# Altium schematic sheet [03] - MODULE BLE.SchDoc
size A3; CompanyName: FPT-FTI copporation; Address1: FPT Building Duy Tan; Address2: Floor 4,; DocumentNumber: 3; SheetNumber: 3; SheetTotal: 8; NameAuthor: Angle Vu
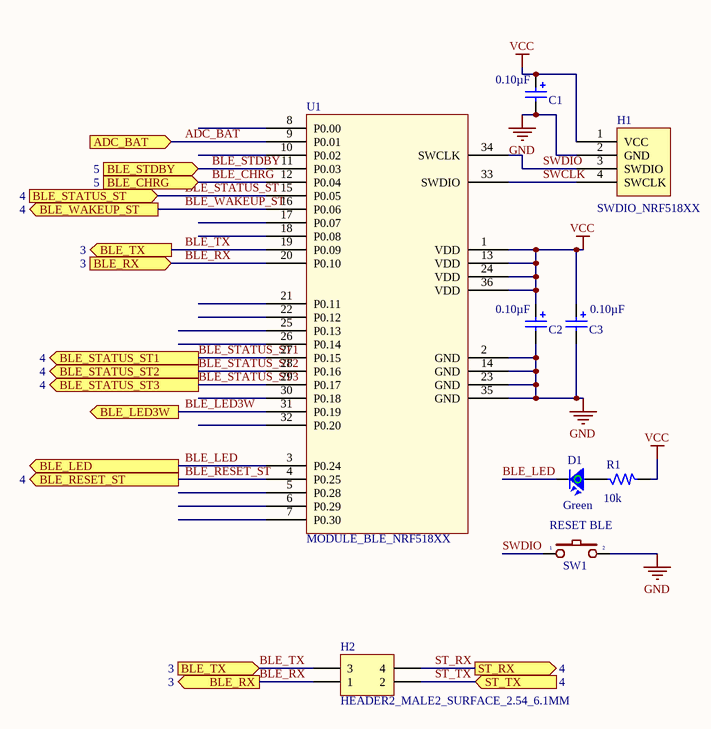
[diagram p0: [03] - MODULE BLE.SchDoc]

## Parts
C1  Capacitance: 0.10µF  [CAP_SMD0603]  (hidden comment: C_104_0603_CERAMIC_16V)
C2  Capacitance: 0.10µF  [CAP_SMD0603]  (hidden comment: C_104_0603_CERAMIC_16V)
C3  Capacitance: 0.10µF  [CAP_SMD0603]  (hidden comment: C_104_0603_CERAMIC_16V)
D1  Color: Green  [LED_GREEN_SMD0603]  (hidden comment: LED2_GREEN_0603_2V)
H1  SWDIO_NRF518XX  [HEADER4_ISP_NRF518xx_SUR1.27]
H2  HEADER2_MALE2_SURFACE_2.54_6.1MM  [HEADER2_MALE2_SUR2.54]
R1  Resistance (Ohms): 10k  [RES_SMD0603]  (hidden comment: R_10K_SMD0603_1%_1/10W)
SW1  RESET BLE  [SW2-SMD]
U1  MODULE_BLE_NRF518XX  [MODULE_NRF518xx]

## Ports
ADC_BAT (in), BLE_CHRG (in, see 5), BLE_LED3W (out), BLE_LED (out), BLE_RESET_ST (out, see 4), BLE_RX (in, see 3), BLE_RX (out, see 3), BLE_STATUS_ST1 (out, see 4), BLE_STATUS_ST2 (out, see 4), BLE_STATUS_ST3 (out, see 4), BLE_STATUS_ST (in, see 4), BLE_STDBY (in, see 5), BLE_TX (in, see 3), BLE_TX (out, see 3), BLE_WAKEUP_ST (out, see 4), ST_RX (out, see 4), ST_TX (in, see 4)

## Nets
GND: C1.2 C2.2 C3.2 H1.2(GND) SW1.2 U1.2(GND) U1.14(GND) U1.23(GND) U1.35(GND)
VCC: C1.1 C2.1 C3.1 H1.1(VCC) R1.2 U1.1(VDD) U1.13(VDD) U1.24(VDD) U1.36(VDD)
ADC_BAT: U1.9(P0.01) ; port ADC_BAT
BLE_CHRG: U1.12(P0.04) ; port BLE_CHRG
BLE_LED: D1.2 U1.3(P0.24) ; port BLE_LED
BLE_LED3W: U1.31(P0.19) ; port BLE_LED3W
BLE_RESET_ST: U1.4(P0.25) ; port BLE_RESET_ST
BLE_RX: H2.1 U1.20(P0.10) ; port BLE_RX
BLE_STATUS_ST: U1.15(P0.05) ; port BLE_STATUS_ST
BLE_STATUS_ST1: U1.27(P0.15) ; port BLE_STATUS_ST1
BLE_STATUS_ST2: U1.28(P0.16) ; port BLE_STATUS_ST2
BLE_STATUS_ST3: U1.29(P0.17) ; port BLE_STATUS_ST3
BLE_STDBY: U1.11(P0.03) ; port BLE_STDBY
BLE_TX: H2.3 U1.19(P0.09) ; port BLE_TX
BLE_WAKEUP_ST: U1.16(P0.06) ; port BLE_WAKEUP_ST
ST_RX: H2.4 ; port ST_RX
ST_TX: H2.2 ; port ST_TX
SWCLK: H1.4(SWCLK) U1.33(SWDIO)
SWDIO: H1.3(SWDIO) SW1.1 U1.34(SWCLK)
NetD1_1: D1.1 R1.1

Not connected (* = marked no-connect by the designer): U1 5(P0.28) 6(P0.29) 7(P0.30) 8(P0.00) 10(P0.02) 17(P0.07) 18(P0.08) 21(P0.11) 22(P0.12) 25(P0.13) 26(P0.14) 30(P0.18) 32(P0.20)

## Notes on the sheet
- Designed By
- Checked By
- Company:
- Size:
- A3
- Address:
- Sheet:
- /

## Library data of the parts
C1-C3 = C_104_0603_CERAMIC_16V: CAP CER 0.1UF 16V X7R 0603; Manufacturer: Murata Electronics North America; Manufacturer Part Number: GRM188R71C104KA01D; Tolerance: ±10%; Supplier 1: Digi-Key; RoHS: RoHS Compliant; Category: Capacitors; Stock 1: 3132000; Pricing 1: 4000=0.00359, 8000=0.00328, 12000=0.00312, 28000=0.00296, 100000=0.00215 (USD); Packaging: Tape & Reel (TR); Part Status: Active; Voltage - Rated: 16V; Temperature Coefficient: X7R; Mounting Type: Surface Mount, MLCC; Operating Temperature: -55°C ~ 125°C; Applications: General Purpose; Ratings: -; Package / Case: 0603 (1608 Metric); Size / Dimension: 0.063" L x 0.031" W (1.60mm x 0.80mm); Height - Seated (Max): -; Thickness (Max): 0.035" (0.90mm); Lead Spacing: -; Features: -; Lead Style: -; ComponentLink1URL: http://www.murata.com/~/media/webrenewal/support/library/catalog/products/capacitor/mlcc/c02e.pdf; ComponentLink1Description: http://www.murata.com/~/media/webrenewal/support/library/catalog/products/capacitor/mlcc/c02e.pdf; Supplier Part Number 1: 490-1532-2-ND
D1 = LED2_GREEN_0603_2V: LED GREEN CLEAR 0603 SMD; Manufacturer: Lite-On Inc.; Manufacturer Part Number: LTST-C191KGKT; Lens Color: Colorless; Millicandela Rating: 35mcd; Lens Style/Size: Rectangle with Flat Top, 1.10mm x 0.80mm; Voltage - Forward (Vf) (Typ): 2V; Current - Test: 20mA; Viewing Angle: 130°; Wavelength - Dominant: 571nm; Wavelength - Peak: 574nm; Supplier 1: Digi-Key; RoHS: RoHS Compliant; Category: Optoelectronics; Stock 1: 960000; Pricing 1: 5000=0.0404, 10000=0.03636, 25000=0.03232, 50000=0.02929, 125000=0.02727 (USD); Packaging: Tape & Reel (TR); Part Status: Active; Lens Transparency: Clear; Mounting Type: Surface Mount; Features: -; Package / Case: 0603 (1608 Metric); Supplier Device Package: *; Size / Dimension: 1.60mm L x 0.80mm W; Height (Max): 0.55mm; ComponentLink1URL: http://optoelectronics.liteon.com/upload/download/DS22-2000-228/S_110_LTST-C191KGKT.pdf; ComponentLink1Description: http://optoelectronics.liteon.com/upload/download/DS22-2000-228/S_110_LTST-C191KGKT.pdf; Supplier Part Number 1: 160-1446-2-ND
H1 = HEADER4_ISP_NRF518XX_HOLE_2.54: CONN HEADER 4POS .100 STR TIN; Manufacturer: Amphenol FCI; Manufacturer Part Number: 68002-404HLF; Connector Type: Header, Unshrouded; Number of Positions: 4; Number of Positions Loaded: All; Pitch: 0.100" (2.54mm); Supplier 1: Digi-Key; RoHS: RoHS Compliant; Category: Connectors, Interconnects; Stock 1: 5773; Pricing 1: 1=0.2, 10=0.186, 25=0.1588, 100=0.129, 250=0.11408, 500=0.10912, 1000=0.08928, 2500=0.08184, 5000=0.07936 (USD); Packaging: Bulk; Part Status: Active; Contact Type: Male Pin; Number of Rows: 1; Row Spacing: -; Contact Mating Length: 0.230" (5.84mm); Mounting Type: Through Hole; Termination: Solder; Fastening Type: -; Features: -; Contact Finish: Tin; Contact Finish Thickness: 100µin (2.54µm); Color: Black; ComponentLink1URL: http://portal.fciconnect.com/Comergent//fci/drawing/68000.pdf; ComponentLink1Description: http://portal.fciconnect.com/Comergent//fci/drawing/68000.pdf; Supplier Part Number 1: 609-3305-ND
H2 = HEADER2_MALE2_SURFACE_2.54_6.1MM: CONN HEADER 4POS TIN SMD; Manufacturer: Molex, LLC; Manufacturer Part Number: 0015912040; Connector Type: Header, Unshrouded, Breakaway; Number of Positions: 4; Number of Positions Loaded: All; Pitch: 0.100" (2.54mm); Supplier 1: Digi-Key; RoHS: RoHS Compliant; Category: Connectors, Interconnects; Stock 1: 10914; Pricing 1: 1=0.44, 10=0.42, 25=0.3596, 50=0.3058, 100=0.2938, 250=0.2638, 500=0.2518, 1000=0.20983, 2500=0.19184 (USD); Packaging: Bulk; Part Status: Active; Contact Type: Male Pin; Number of Rows: 2; Row Spacing: 0.100" (2.54mm); Contact Mating Length: 0.240" (6.10mm); Mounting Type: Surface Mount; Termination: Solder; Fastening Type: -; Features: -; Contact Finish: Tin; Contact Finish Thickness: 150µin (3.81µm); Color: Black; ComponentLink1URL: http://www.molex.com/pdm_docs/sd/015912040_sd.pdf; ComponentLink1Description: http://www.molex.com/pdm_docs/sd/015912040_sd.pdf; Supplier Part Number 1: WM9514-ND; ComponentLink2URL: http://www.te.com/commerce/DocumentDelivery/DDEController?Action=srchrtrv&DocNm=640456&DocType=Customer+Drawing&DocLang=English; ComponentLink2Description: http://www.te.com/commerce/DocumentDelivery/DDEController?Action=srchrtrv&DocNm=640456&DocType=Customer+Drawing&DocLang=English
R1 = R_10K_SMD0603_1%_1/10W: RES SMD 10K OHM 1% 1/10W 0603; Manufacturer: Yageo; Manufacturer Part Number: RC0603FR-0710KL; Power (Watts): 0.1W, 1/10W; Temperature Coefficient: ±100ppm/°C; Capacitance: 0.10µF; Voltage - Rated: 50V; Supplier 1: Digi-Key; RoHS: RoHS Compliant; Category: Resistors; Stock 1: 10005000; Pricing 1: 5000=0.00167, 10000=0.00145, 25000=0.00128, 50000=0.00117, 125000=0.00115 (USD); Packaging: Tape & Reel (TR); Part Status: Active; Tolerance: ±1%; Composition: Thick Film; Features: Moisture Resistant; Operating Temperature: -55°C ~ 155°C; Package / Case: 0603 (1608 Metric); Supplier Device Package: 0603; Size / Dimension: 0.063" L x 0.031" W (1.60mm x 0.80mm); Height: 0.022" (0.55mm); Number of Terminations: 2; ComponentLink1URL: http://www.yageo.com/documents/recent/PYu-RC_Group_51_RoHS_L_04.pdf; ComponentLink1Description: http://www.yageo.com/documents/recent/PYu-RC_Group_51_RoHS_L_04.pdf; Supplier Part Number 1: 311-10.0KHRTR-ND; Mounting Type: Surface Mount, MLCC; Applications: General Purpose; Ratings: -; Height - Seated (Max): -; Thickness (Max): 0.037" (0.94mm); Lead Spacing: -; Lead Style: -; ComponentLink2URL: http://datasheets.avx.com/X7RDielectric.pdf; ComponentLink2Description: http://datasheets.avx.com/X7RDielectric.pdf
SW1 = SW2_DPST_SURFACE_5MM: SWITCH TACTILE SPST-NO 0.05A 12V; Manufacturer: Wurth Electronics Inc; Manufacturer Part Number: 434121050836; Switch Function: Off-Mom; Contact Rating @ Voltage: 0.05A @ 12VDC; Actuator Type: Rectangular Button; Actuator Height off PCB, from Pins: 5.00mm; Actuator Orientation: Top Actuated; Outline: 6.00mm x 3.50mm; Illumination: Non-Illuminated; Operating Force: 360gf; Actuator Material: Liquid Crystal Polymer (LCP); Switch Travel: 0.25mm; Mechanical Life: 50,000 Cycles; Supplier 1: Digi-Key; RoHS: RoHS Compliant; Category: Switches; Stock 1: 0; Pricing 1: 1500=0.27 (USD); Packaging: Tape & Reel (TR); Part Status: Active; Circuit: SPST-NO; Mounting Type: Surface Mount; Termination Style: SMD (SMT) Tab; Illumination Voltage (Nominal): -; Illumination Type, Color: -; Ingress Protection: -; Features: -; Operating Temperature: -40°C ~ 85°C; ComponentLink1URL: http://katalog.we-online.de/em/datasheet/434121050836.pdf; ComponentLink1Description: http://katalog.we-online.de/em/datasheet/434121050836.pdf; Supplier Part Number 1: 732-7049-2-ND
U1 = MODULE_BLE_NRF518XX: PACKAGE: SURFACE_1.27MM; PIN: 36